# EasyEDA Pro project PCB.eprj, board A/B_Register
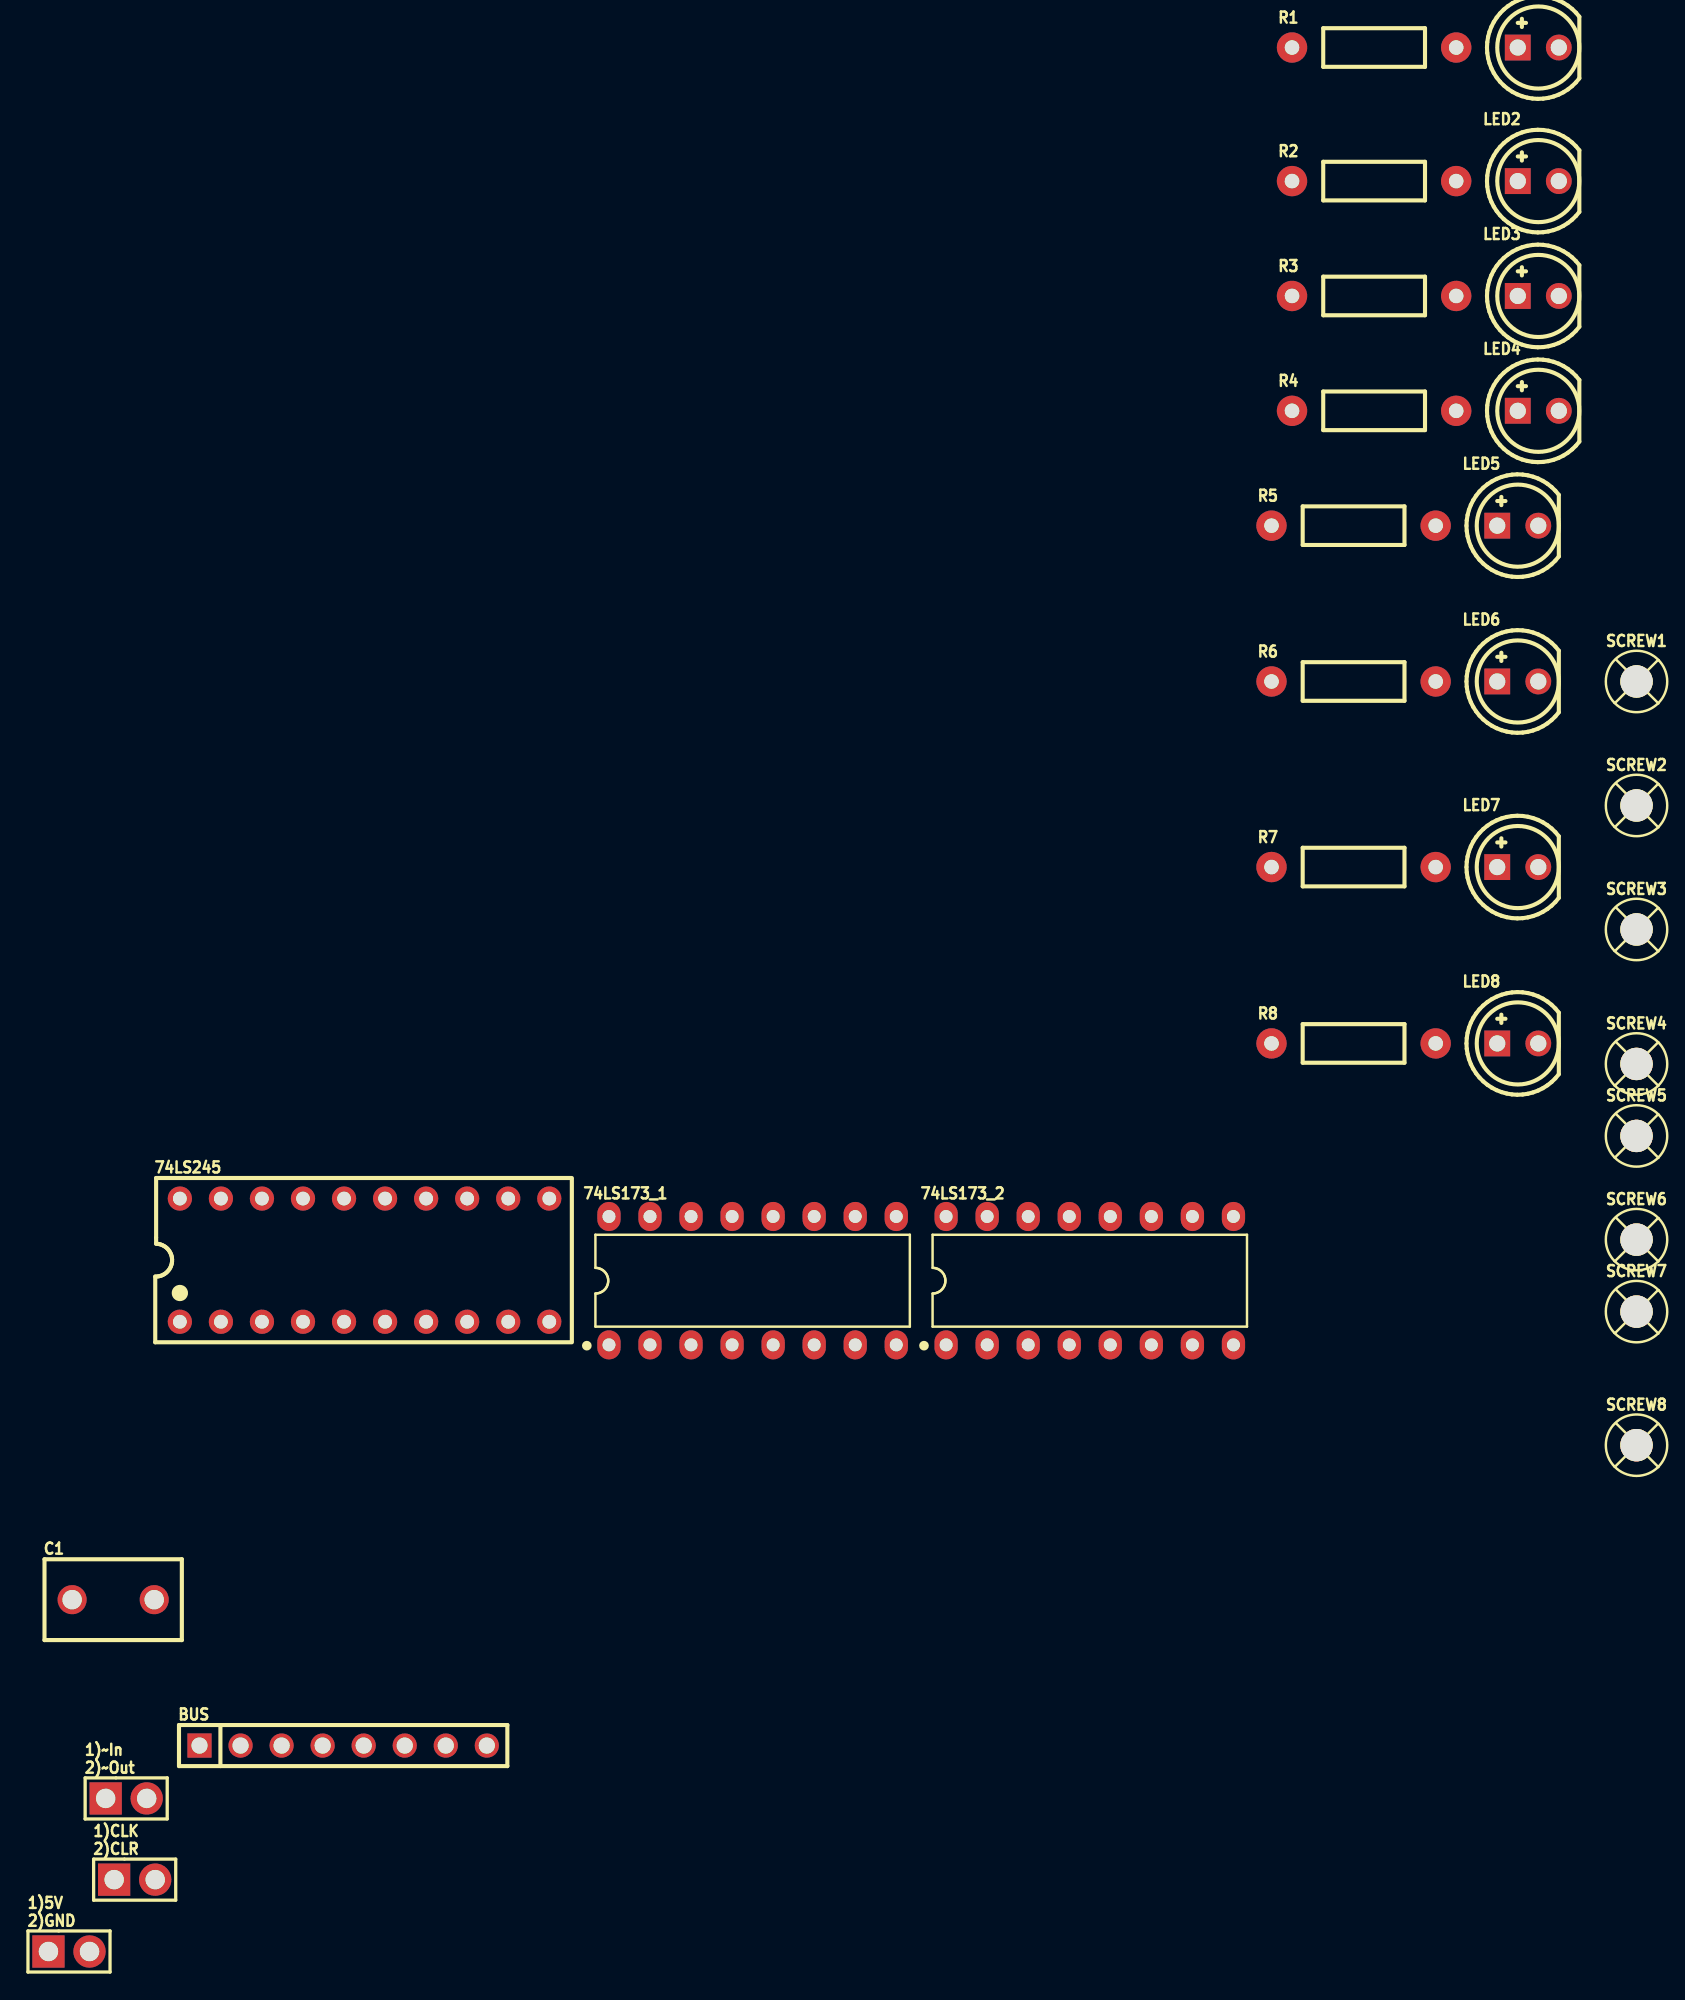
[diagram p6: board, top side]
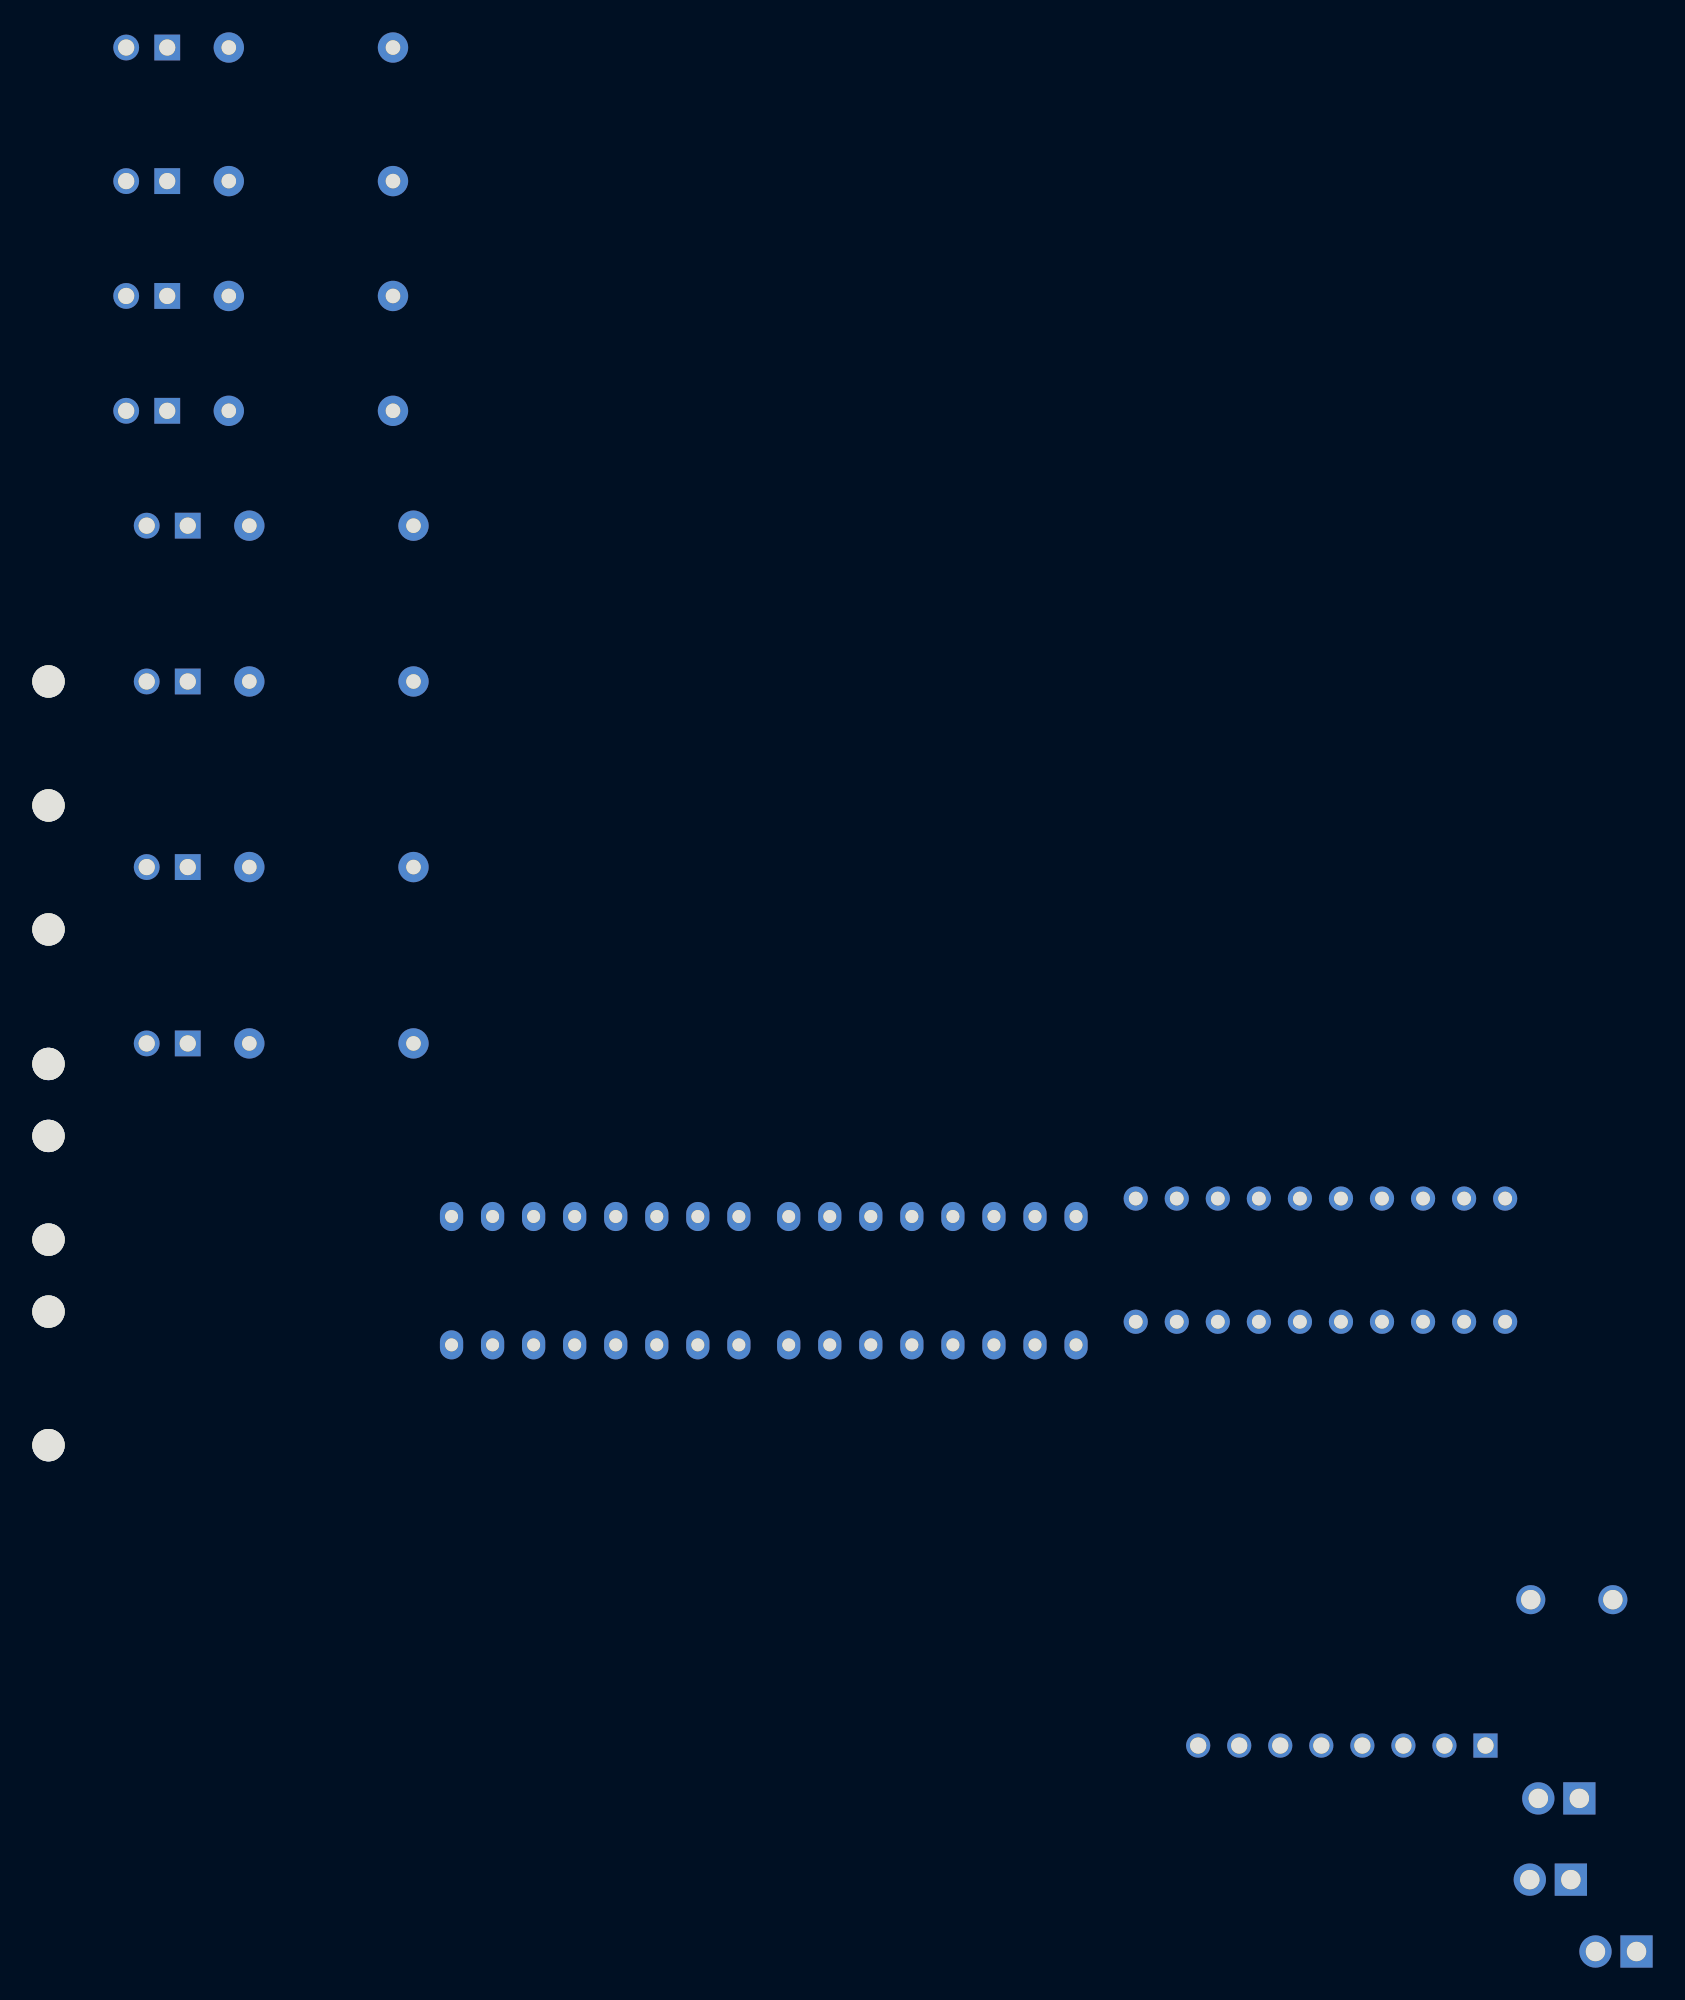
[diagram p7: board, bottom side, seen from below]

No outline. copper layers: Top Layer, Bottom Layer. Coordinates in mm from the lowest, leftmost part position.
Stack: Top Layer 0.035mm / Dielectric1 1.51mm FR4 er 4.5 / Bottom Layer 0.035mm

## Design rules (mm)
template: JLCPCB Capability(Two Layers Board)
spacing copperThickness1oz (default): track to track 0.102, other pairs 0.152 to 0.3
spacing copperThickness2oz: track to track 0.203, other pairs 0.152 to 0.3
track width copperThickness1oz (default): min 0.127, default 0.254, max 2.54
track width copperThickness2oz: min 0.203, default 0.254, max 2.54
differential pair differentialPair (default): width min 0.127, default 0.254, max 2.54; gap min 0.152, default 0.152
via viaSize (default): diameter min 0.5, default 0.61, max 10; hole min 0.3, default 0.305, max 6.3

## Placement (name value [footprint] x y rotation side)
1)5V
2)GND  PZ254V-11-02P  [HDR-TH_2P-P2.54-V-M]  0 0 0 top
1)CLK
2)CLR  PZ254V-11-02P  [HDR-TH_2P-P2.54-V-M]  4.06 4.44 0 top
1)~In
2)~Out  PZ254V-11-02P  [HDR-TH_2P-P2.54-V-M]  3.54 9.47 0 top
74LS173_1  SN74LS173AN  [PDIP-16_L19.3-W6.4-P2.54-LS7.94-BL]  42.3 41.49 0 top
74LS173_2  SN74LS173AN  [PDIP-16_L19.3-W6.4-P2.54-LS7.94-BL]  63.17 41.49 0 top
74LS245  SN74LS245N  [DIP-20_L25.5-W10.0-P2.54-LS7.6-BL]  18.29 42.76 0 top
BUS  PZ254V-11-08P  [HDR-TH_8P-P2.54-V-M]  16.97 12.74 0 top
C1  100nF  [CAP-TH_L8.5-W5.0-P5.00-D1.2]  2.73 21.76 0 top
LED1  -  [LED-TH_BD5.8-P2.54-FD]  90.92 117.77 0 top
LED2  -  [LED-TH_BD5.8-P2.54-FD]  90.92 109.5 0 top
LED3  -  [LED-TH_BD5.8-P2.54-FD]  90.92 102.4 0 top
LED4  -  [LED-TH_BD5.8-P2.54-FD]  90.92 95.3 0 top
LED5  -  [LED-TH_BD5.8-P2.54-FD]  89.65 88.19 0 top
LED6  -  [LED-TH_BD5.8-P2.54-FD]  89.65 78.55 0 top
LED7  -  [LED-TH_BD5.8-P2.54-FD]  89.65 67.07 0 top
LED8  -  [LED-TH_BD5.8-P2.54-FD]  89.65 56.17 0 top
R1  220  [R_AXIAL-0.4]  80.76 117.77 0 top
R2  220  [R_AXIAL-0.4]  80.76 109.5 0 top
R3  220  [R_AXIAL-0.4]  80.76 102.4 0 top
R4  220  [R_AXIAL-0.4]  80.76 95.3 0 top
R5  220  [R_AXIAL-0.4]  79.49 88.19 0 top
R6  220  [R_AXIAL-0.4]  79.49 78.55 0 top
R7  220  [R_AXIAL-0.4]  79.49 67.07 0 top
R8  220  [R_AXIAL-0.4]  79.49 56.17 0 top
SCREW1  -  [Screw-Hole-M2]  97 78.55 0 top
SCREW2  -  [Screw-Hole-M2]  97 70.88 0 top
SCREW3  -  [Screw-Hole-M2]  97 63.22 0 top
SCREW4  -  [Screw-Hole-M2]  97 54.9 0 top
SCREW5  -  [Screw-Hole-M2]  97 50.44 0 top
SCREW6  -  [Screw-Hole-M2]  97 44.03 0 top
SCREW7  -  [Screw-Hole-M2]  97 39.58 0 top
SCREW8  -  [Screw-Hole-M2]  97 31.32 0 top

## Footprints (pads in the part's own frame, mm; a bottom-side part is the same pattern mirrored in y, then rotated)
CAP-TH_L8.5-W5.0-P5.00-D1.2
  round 1.8 hole 1.2: 1(-2.54,0) 2(2.54,0)
DIP-20_L25.5-W10.0-P2.54-LS7.6-BL
  round 1.5 hole 0.85: 1(-11.43,-3.81) 2(-8.89,-3.81) 3(-6.35,-3.81) 4(-3.81,-3.81) 5(-1.27,-3.81) 6(1.27,-3.81) 7(3.81,-3.81) 8(6.35,-3.81) 9(8.89,-3.81) 10(11.43,-3.81) 11(11.43,3.81) 12(8.89,3.81) 13(6.35,3.81) 14(3.81,3.81) 15(1.27,3.81) 16(-1.27,3.81) 17(-3.81,3.81) 18(-6.35,3.81) 19(-8.89,3.81) 20(-11.43,3.81)
HDR-TH_2P-P2.54-V-M
  rect 2x2 hole 1.2: 1(-1.27,0)
  round 2 hole 1.2: 2(1.27,0)
HDR-TH_8P-P2.54-V-M
  rect 1.5x1.5 hole 1: 1(-8.89,0)
  round 1.5 hole 1: 2(-6.35,0) 3(-3.81,0) 4(-1.27,0) 5(1.27,0) 6(3.81,0) 7(6.35,0) 8(8.89,0)
LED-TH_BD5.8-P2.54-FD
  rect 1.6x1.6 hole 1: 1(-1.27,0)
  round 1.6 hole 1: 2(1.27,0)
PDIP-16_L19.3-W6.4-P2.54-LS7.94-BL
  oval 1.44x1.8 hole 0.8: 1(-8.89,-3.97) 2(-6.35,-3.97) 3(-3.81,-3.97) 4(-1.27,-3.97) 5(1.27,-3.97) 6(3.81,-3.97) 7(6.35,-3.97) 8(8.89,-3.97) 9(8.89,3.97) 10(6.35,3.97) 11(3.81,3.97) 12(1.27,3.97) 13(-1.27,3.97) 14(-3.81,3.97) 15(-6.35,3.97) 16(-8.89,3.97)
R_AXIAL-0.4
  round 1.879 hole 0.899: 1(-5.08,0) 2(5.08,0)
Screw-Hole-M2
  round 2 hole 2: 1(0,0)

## Nets
+5V: 1)5V
2)GND.1 74LS173_1.16 74LS173_2.16 74LS245.1 74LS245.20 C1.2
GND: 1)5V
2)GND.2 74LS173_1.1 74LS173_1.2 74LS173_1.8 74LS173_2.1 74LS173_2.2 74LS173_2.8 74LS245.10 C1.1 LED1.2 LED2.2 LED3.2 LED4.2 LED5.2 LED6.2 LED7.2 LED8.2
1: 74LS173_1.3 74LS245.2 R1.1 SCREW1.1
2: 74LS173_1.4 74LS245.3 R2.1 SCREW2.1
3: 74LS173_1.5 74LS245.4 R3.1 SCREW3.1
4: 74LS173_1.6 74LS245.5 R4.1 SCREW4.1
5: 74LS173_2.3 74LS245.6 R5.1 SCREW5.1
6: 74LS173_2.4 74LS245.7 R6.1 SCREW6.1
7: 74LS173_2.5 74LS245.8 R7.1 SCREW7.1
8: 74LS173_2.6 74LS245.9 R8.1 SCREW8.1
BUS_1: 74LS173_1.14 74LS245.18 BUS.1
BUS_2: 74LS173_1.13 74LS245.17 BUS.2
BUS_3: 74LS173_1.12 74LS245.16 BUS.3
BUS_4: 74LS173_1.11 74LS245.15 BUS.4
BUS_5: 74LS173_2.14 74LS245.14 BUS.5
BUS_6: 74LS173_2.13 74LS245.13 BUS.6
BUS_7: 74LS173_2.12 74LS245.12 BUS.7
BUS_8: 74LS173_2.11 74LS245.11 BUS.8
CLK: 1)CLK
2)CLR.1 74LS173_1.7 74LS173_2.7
CLR: 1)CLK
2)CLR.2 74LS173_1.15 74LS173_2.15
~IN: 1)~In
2)~Out.1 74LS173_1.9 74LS173_1.10 74LS173_2.9 74LS173_2.10
~OUT: 1)~In
2)~Out.2 74LS245.19
$1N2729: LED1.1 R1.2
$1N2738: LED8.1 R8.2
$1N2739: LED7.1 R7.2
$1N2740: LED6.1 R6.2
$1N2741: LED5.1 R5.2
$1N2742: LED4.1 R4.2
$1N2743: LED3.1 R3.2
$1N2744: LED2.1 R2.2
